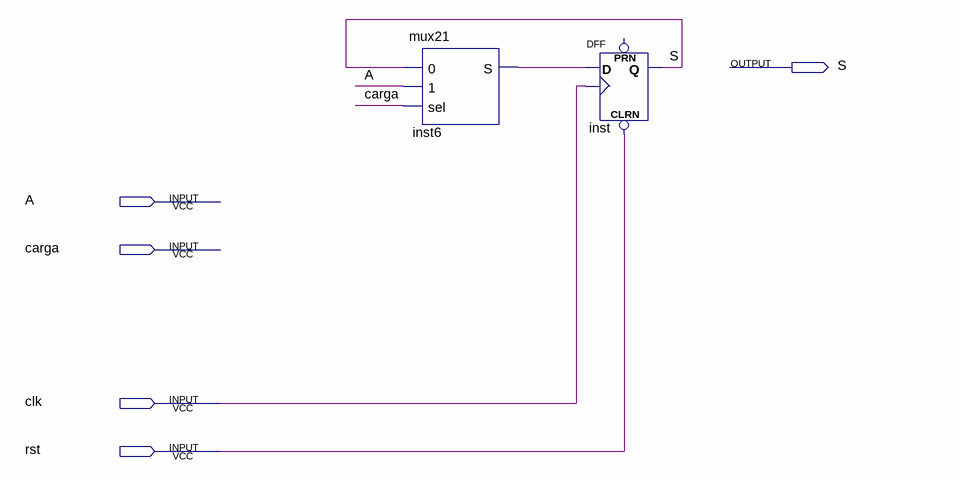
[diagram p0: schematic sheet]
// Quartus schematic flag.bdf as structural Verilog: 2 symbols, 5 pins
module flag (
  input  A,
  input  carga,
  input  clk,
  input  rst,
  output S
);

  wire inst6_s;

  mux21 inst6 (.\0 (S), .\1 (A), .sel(carga), .S(inst6_s));
  DFF inst (.CLRN(rst), .CLK(clk), .D(inst6_s), .Q(S));  // open: PRN
endmodule
